# Altium schematic sheet STM32_LED_FROM MUSIC.SchDoc
size A4; SheetNumber: 1; SheetTotal: 1
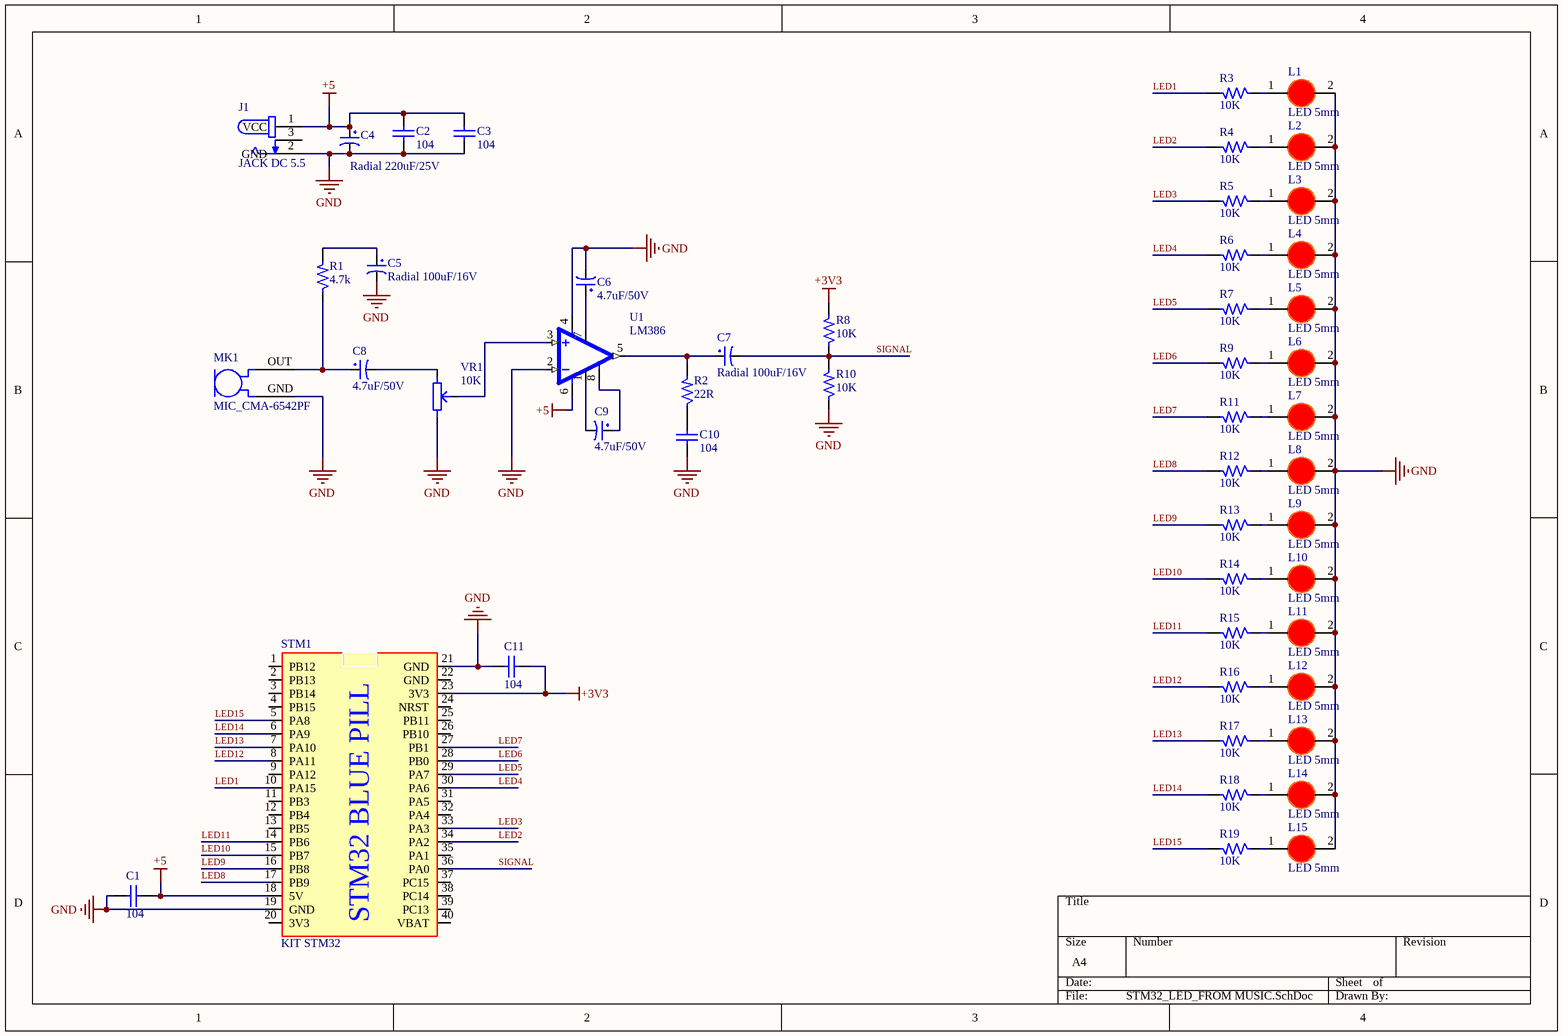
[diagram p0: STM32_LED_FROM MUSIC.SchDoc]

## Parts
C1  104  [Cap Ceramic 0805]
C2  104  [Cap Ceramic 0805]
C3  104  [Cap Ceramic 0805]
C4  Radial 220uF/25V  [Radial 6.3x12mm]
C5  Radial 100uF/16V  [Radial 5x11mm]
C6  4.7uF/50V  [Radial 4.7uF/50V]
C7  Radial 100uF/16V  [Radial 5x11mm]
C8  4.7uF/50V  [Radial 4.7uF/50V]
C9  4.7uF/50V  [Radial 4.7uF/50V]
C10  104  [Cap Ceramic 0805]
C11  104  [Cap Ceramic 0805]
J1  JACK DC 5.5  [JACK DC]
L1  LED 5mm  [LED-5MM-RED]
L2  LED 5mm  [LED-5MM-RED]
L3  LED 5mm  [LED-5MM-RED]
L4  LED 5mm  [LED-5MM-RED]
L5  LED 5mm  [LED-5MM-RED]
L6  LED 5mm  [LED-5MM-RED]
L7  LED 5mm  [LED-5MM-RED]
L8  LED 5mm  [LED-5MM-RED]
L9  LED 5mm  [LED-5MM-RED]
L10  LED 5mm  [LED-5MM-RED]
L11  LED 5mm  [LED-5MM-RED]
L12  LED 5mm  [LED-5MM-RED]
L13  LED 5mm  [LED-5MM-RED]
L14  LED 5mm  [LED-5MM-RED]
L15  LED 5mm  [LED-5MM-RED]
MK1  MIC_CMA-6542PF  [CUI_CMA-6542PF]
R1  4.7k  [Res_0805]
R2  22R  [Res_0805]
R3  10K  [Res_0805]
R4  10K  [Res_0805]
R5  10K  [Res_0805]
R6  10K  [Res_0805]
R7  10K  [Res_0805]
R8  10K  [Res_0805]
R9  10K  [Res_0805]
R10  10K  [Res_0805]
R11  10K  [Res_0805]
R12  10K  [Res_0805]
R13  10K  [Res_0805]
R14  10K  [Res_0805]
R15  10K  [Res_0805]
R16  10K  [Res_0805]
R17  10K  [Res_0805]
R18  10K  [Res_0805]
R19  10K  [Res_0805]
STM1  KIT STM32  [STM32 blue pill]
U1  LM386  [LM358SMD]
VR1  10K  [Bien Tro Tam Giac Dung]

## Nets
+3V3: C11.2 R8.2 STM1.23(3V3)
+5: C1.2 C2.2 C3.2 C4.1 J1.1(VCC) STM1.18(5V) U1.6(V+)
GND: C1.1 C2.1 C3.1 C4.2 C5.2 C6.2 C10.1 C11.1 J1.2(GND) L1.2(K) L2.2(K) L3.2(K) L4.2(K) L5.2(K) L6.2(K) L7.2(K) L8.2(K) L9.2(K) L10.2(K) L11.2(K) L12.2(K) L13.2(K) L14.2(K) L15.2(K) MK1.GND R10.1 STM1.19(GND) STM1.21(GND) U1.2(-IN) U1.4(V-) VR1.3
LED1: R3.2 STM1.10(PA15)
LED2: R4.2 STM1.34(PA2)
LED3: R5.2 STM1.33(PA3)
LED4: R6.2 STM1.30(PA6)
LED5: R7.2 STM1.29(PA7)
LED6: R9.2 STM1.28(PB0)
LED7: R11.2 STM1.27(PB1)
LED8: R12.2 STM1.17(PB9)
LED9: R13.2 STM1.16(PB8)
LED10: R14.2 STM1.15(PB7)
LED11: R15.2 STM1.14(PB6)
LED12: R16.2 STM1.8(PA11)
LED13: R17.2 STM1.7(PA10)
LED14: R18.2 STM1.6(PA9)
LED15: R19.2 STM1.5(PA8)
SIGNAL: C7.2 R8.1 R10.2 STM1.36(PA0)
NetC5_1: C5.1 R1.2
NetC6_1: C6.1 U1.7(BP)
NetC7_1: C7.1 R2.2 U1.5(OUT)
NetC8_1: C8.1 MK1.OUT R1.1
NetC8_2: C8.2 VR1.1
NetC9_1: C9.1 U1.8(GAIN@8)
NetC9_2: C9.2 U1.1(GAIN@1)
NetC10_2: C10.2 R2.1
NetL1_1: L1.1(A) R3.1
NetL2_1: L2.1(A) R4.1
NetL3_1: L3.1(A) R5.1
NetL4_1: L4.1(A) R6.1
NetL5_1: L5.1(A) R7.1
NetL6_1: L6.1(A) R9.1
NetL7_1: L7.1(A) R11.1
NetL8_1: L8.1(A) R12.1
NetL9_1: L9.1(A) R13.1
NetL10_1: L10.1(A) R14.1
NetL11_1: L11.1(A) R15.1
NetL12_1: L12.1(A) R16.1
NetL13_1: L13.1(A) R17.1
NetL14_1: L14.1(A) R18.1
NetL15_1: L15.1(A) R19.1
NetU1_3: U1.3(+IN) VR1.2

Not connected (* = marked no-connect by the designer): J1 3; STM1 1(PB12) 2(PB13) 3(PB14) 4(PB15) 9(PA12) 11(PB3) 12(PB4) 13(PB5) 20(3V3) 22(GND) 24(NRST) 25(PB11) 26(PB10) 31(PA5) 32(PA4) 35(PA1) 37(PC15) 38(PC14) 39(PC13) 40(VBAT)

## Library data of the parts
C1-C3 C10 C11 = CAP Ceramic SMD
C6 C8 C9 = Radial 4.7uF/50V: Value: 10uF/50V; Description 1: 10 => 220uF/6,3V/10V - 10uF => 100uF/16V; Description 2: 0,1uF => 33uF/50V - 10uF => 22uF/63V; Description 3: 0,47uF => 10uF/100V
J1 = JACK DC 5.5: 2,0 x 6,5 mm, 2,5 A, Yatay, AÃ§Ä±k Delik, Dc GÃ¼Ã§ JakÄ± KonnektÃ¶rÃ¼; MF: CUI Devices; MP: PJ-002A; Package: None; Price: None; CUI_purchase_URL: https://www.cuidevices.com/product/interconnect/connectors/dc-power-connectors/jacks/pj-002a?utm_source=snapeda.com&utm_medium=referral&utm_campaign=snapedaBOM; SnapEDA_Link: https://www.snapeda.com/parts/PJ-002A/CUI%20Devices/view-part/287588/?ref=snap; Availability: Unavailable; Value: *
L1-L15 = LED 5mm Red: Cắm; Don_Vi: Con; Ma_Hang: MH008967; Ten_Linh_Kien: Led 5MM Phủ Đỏ (1000c); Ghi_Chu: *; Kieu_Chan: *; Chung_Loai: Cắm
MK1 = MIC_CMA-6542PF: 9.7 mm, Omnidirectional, PCB Mount, 4.5 Vdc, Electret Condenser Microphone; MF: CUI Devices; MP: CMA-6542PF; Check_prices: https://www.snapeda.com/parts/CMA-6542PF/CUI+Devices/view-part/?ref=eda; Price: None; Availability: In Stock; Package: None; SnapEDA_Link: https://www.snapeda.com/parts/CMA-6542PF/CUI+Devices/view-part/?ref=snap; Value: *; Purchase-URL: https://pricing.snapeda.com/search/part/CMA-6542PF/?ref=eda; CUI_purchase_URL: https://www.cuidevices.com/product/audio/microphones/electret-condenser-microphones/cma-6542pf?utm_source=snapeda.com&utm_medium=referral&utm_campaign=snapedaBOM
R1-R19 = Res SMD
STM1 = STM32 BLUE PILL
U1 = LM386: low voltage audio power amplifier; MP: LM386; Price: None; Package: None; Value: *; Availability: Unavailable
VR1 = Potentiometer triangle lie: Cắm; Ma_Hang: MH000919; Don_Vi: Con; Ten_Linh_Kien: Biến Trở Tam Giác 103-10K RM065 (Chân Đứng); Chung_Loai: Cắm; Kieu_Chan: *